# EasyEDA Pro project LUME_PEN_EasyEDA_Project_V1.2_2026-06-28.epro, schematic Charger_SCH
Board Name: 02_Charger; Create Date: 2026-05-08; Page Name: P1; Project Name: LUME; Schematic Name: Charger_SCH; Update Date: 2026-06-19; Company: EasyEDA.com; Page Size: A4; Version: V1.0
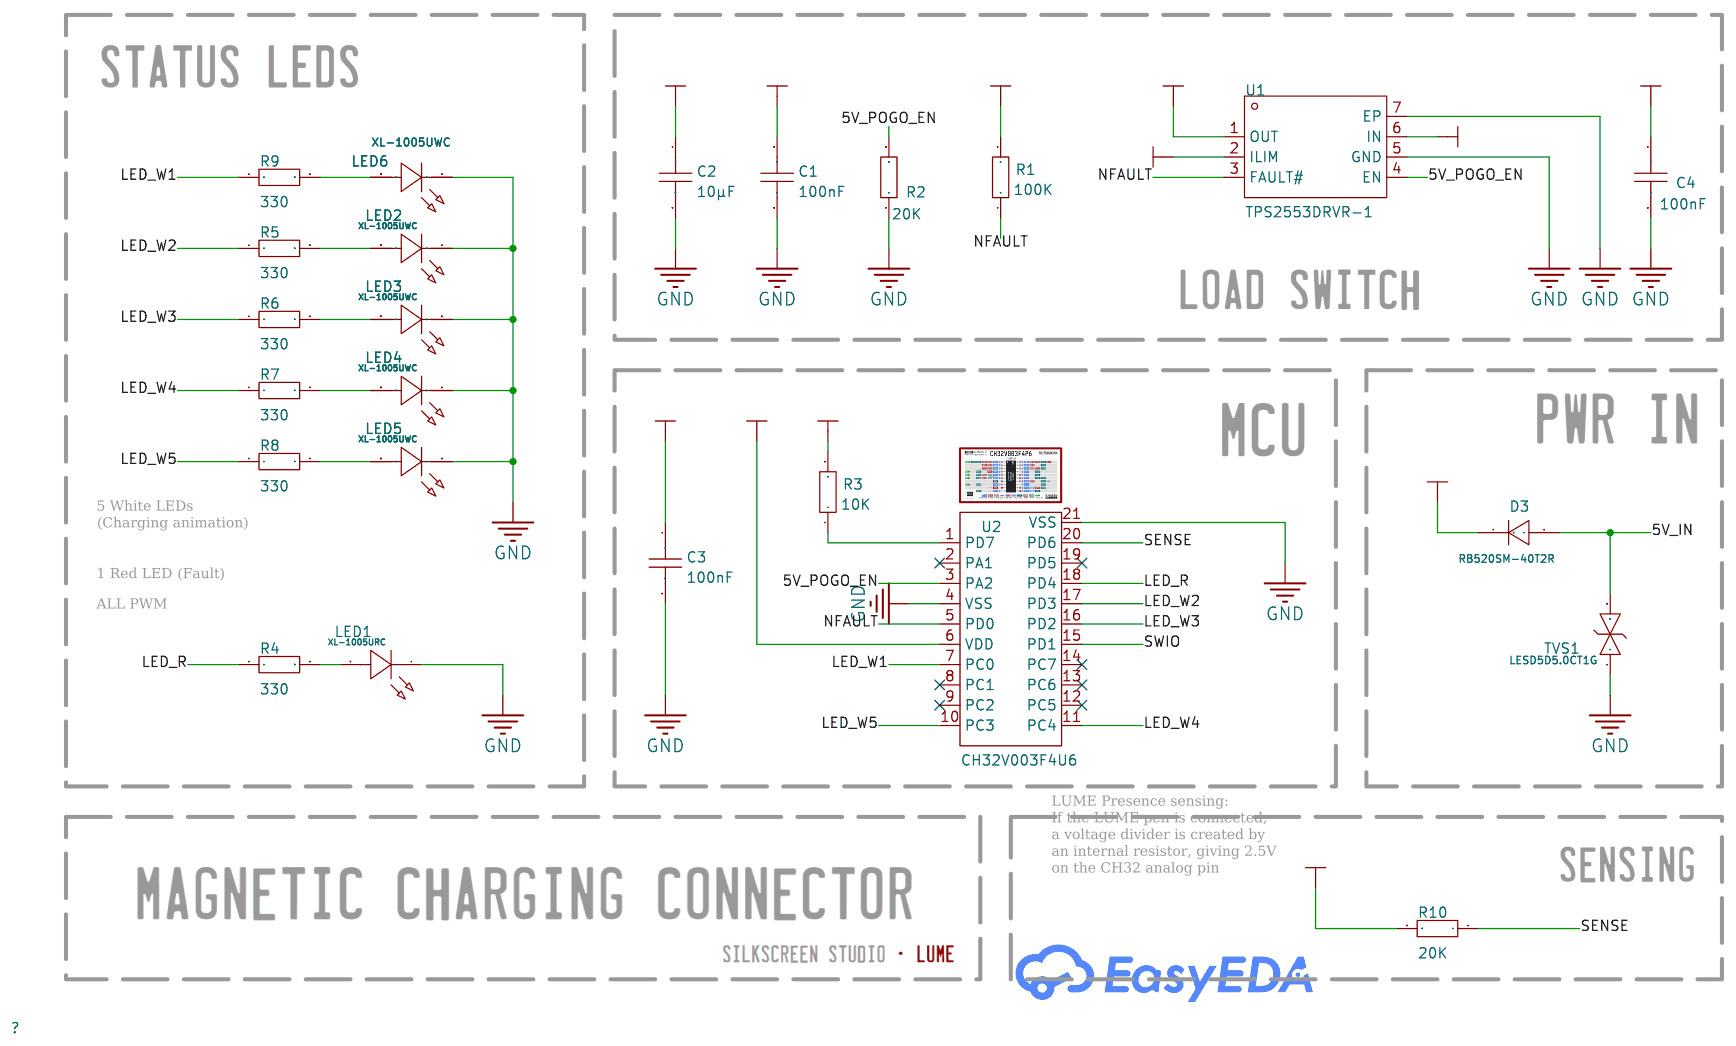
[diagram p1: schematic sheet]

## Parts
C1  100nF  [C0402]
C2  10µF  [C0402]
C3  100nF  [C0402]
C4  100nF  [C0402]
D3  RB520SM-40T2R  [SOD-523F_L1.7-W0.9-LS1.7-RD]
LED1  XL-1005URC  [LED0402-RD_YELLOW]
LED2  XL-1005UWC  [LED0402-RD_YELLOW]
LED3  XL-1005UWC  [LED0402-RD_YELLOW]
LED4  XL-1005UWC  [LED0402-RD_YELLOW]
LED5  XL-1005UWC  [LED0402-RD_YELLOW]
LED6  XL-1005UWC  [LED0402-RD_YELLOW]
R1  100K  [R0402]
R2  20K  [R0402]
R3  10K  [R0402]
R4  330  [R0402]
R5  330  [R0402]
R6  330  [R0402]
R7  330  [R0402]
R8  330  [R0402]
R9  330  [R0402]
R10  20K  [R0402]
TVS1  LESD5D5.0CT1G  [SOD-523_L1.2-W0.8-LS1.6-BI]
U1  TPS2553DRVR-1  [WSON-6_L2.0-W2.0-P0.65-BL-EP]
U2  CH32V003F4U6  [QFN-20_L3.0-W3.0-P0.40-TL-EP1.7]

## Library data of the parts
C1-C4 = CAP_0402: Supplier Part: C1525; Supplier Footprint: 0402
D3 = RB520SM-40T2R: Voltage - Forward(Vf@If):550mV@100mA Voltage - DC Reverse(Vr):40V Current - Rectified:200mA Reverse Leakage Current (Ir):10uA@40V Non-Repetitive Peak Forward Surge Current:1A; LCSC Part Name: 电压:40V 电流:200mA; Supplier Part: C253514; Manufacturer: ROHM(罗姆); Supplier Footprint: SOD-523; JLCPCB Part Class: Extended Part; Datasheet: https://item.szlcsc.com/datasheet/RB520SM-40T2R/248204.html; Supplier: LCSC; Voltage - Forward(Vf@If): 550mV@100mA; Voltage - DC Reverse(Vr): 40V; Current - Rectified: 200mA; Reverse Leakage Current (Ir): 10uA@40V; Non-Repetitive Peak Forward Surge Current: 1A
LED1-LED6 = XL-1005UWC_C20613596: Lamp Holder Type:- Illumination Color:White Voltage - Forward(Vf):2.8V Voltage - Forward(Vf):2.8V Power(Watts):75mW Forward Current:5mA Wavelength - Dominant:- Wavelength - Dominant:- Peak Wavelength:- Diode Configuration:Discrete Diode Lens Color:Yellow; LCSC Part Name: 0402冷白光贴片式发光二极管; Supplier Part: C20613596; Manufacturer: XINGLIGHT(成兴光); Supplier Footprint: 0402; JLCPCB Part Class: Extended Part; Datasheet: https://item.szlcsc.com/datasheet/XL-1005UWC/21979587.html; Supplier: LCSC; Illumination Color: White; Voltage - Forward(Vf): 2.8V; Power(Watts): 75mW; Forward Current: 5mA; Diode Configuration: Discrete Diode; Lens Color: Yellow Lens; Color Temperature: 15000K; Luminous Intensity: 1cd; Viewing Angle: 120°; Mounting Style: Top-mount; Operating Temperature: -40℃~+85℃
R1-R10 = Res_0402: Supplier Footprint: 0402
TVS1 = LESD5D5.0CT1G_C7433850: Polarity:- Reverse Stand-Off Voltage (Vrwm):5V Clamping Voltage:15V Peak Pulse Current (Ipp):5A Peak Pulse Power Dissipation (Ppp):75W Voltage - Breakdown:9V Reverse Leakage Current (Ir):1uA Number of Channels:1.0 Operating Temperature:-40℃~+150℃ Operatin; Supplier Part: C7433850; Manufacturer: KUU; Supplier Footprint: SOD-523; JLCPCB Part Class: Extended Part; Datasheet: https://item.szlcsc.com/datasheet/LESD5D5.0CT1G/8442902.html; Supplier: LCSC; Reverse Stand-Off Voltage (Vrwm): 5V; Clamping Voltage: 15V; Peak Pulse Current (Ipp): 5A; Peak Pulse Power Dissipation (Ppp): 75W; Voltage - Breakdown: 9V; Reverse Leakage Current (Ir): 1uA; Number of Channels: 1.0; Operating Temperature: -40℃~+150℃; level of protection: IEC 61000-4-2；IEC 61000-4-4; Type: ESD; Junction Capacitance: 15pF
U1 = TPS2553DRVR-1: Type:Load Switch Number of Channels:1 Control Input Logic:Active High Maximum Continuous Current:1.5A Voltage - Supply:2.5V~6.5V Voltage - Supply:2.5V~6.5V RDS(on):115mΩ Operating Temperature	-:-40℃~+105℃ Operating Temperature	-:-40℃~+105℃ Features:Overte; LCSC Part Name: 精密可调、带电流限制的电源分配开关; Supplier Part: C411878; Manufacturer: TI(德州仪器); Supplier Footprint: WSON-6-EP(2x2); JLCPCB Part Class: Extended Part; Datasheet: https://www.ti.com/cn/lit/gpn/tps2553-1; Supplier: LCSC; Type: Load Switch; Number of Channels: 1; Control Input Logic: Active High; Maximum Continuous Current: 1.5A; Voltage - Supply: 2.5V~6.5V; RDS(on): 115mΩ; Operating Temperature	-: -40℃~+105℃; Features: Overtemperature protection (OTP)；Overcurrent Protection(OCP)
U2 = CH32V003F4U6: CPU Core:RISC-V CPU Maximum Speed:48MHz Program Storage Size:16KB Number of I/O:18 Applications:-; LCSC Part Name: QingKe V2微处理器; Supplier Part: C5299908; Manufacturer: WCH(南京沁恒); Supplier Footprint: QFN-20(3X3); JLCPCB Part Class: Extended Part; Datasheet: https://item.szlcsc.com/datasheet/CH32V003F4U6/6049934.html; Supplier: LCSC; CPU Core: RISC-V; CPU Maximum Speed: 48MHz; Program Storage Size: 16KB; Number of I/O: 18

## Nets
5V_IN: D3.2(A) TVS1.2
5V_POGO: U1.1(OUT)
5V_POGO_EN: R2.2 U1.4(EN) U2.3(PA2)
GND: C1.2 C2.2 C3.2 C4.2 LED1.1(K) LED2.1(K) LED3.1(K) LED4.1(K) LED5.1(K) LED6.1(K) R2.1 TVS1.1 U1.5(GND) U1.7(EP) U2.4(VSS) U2.21(VSS)
VBUS: C1.1 C2.1 C3.1 C4.1 D3.1(C) R1.2 R3.2 R10.2 U1.2(ILIM) U1.6(IN) U2.6(VDD)
LED_R: R4.1 U2.18(PD4)
LED_W1: R9.1 U2.7(PC0)
LED_W2: R5.1 U2.17(PD3)
LED_W3: R6.1 U2.16(PD2)
LED_W4: R7.1 U2.11(PC4)
LED_W5: R8.1 U2.10(PC3)
NFAULT: R1.1 U1.3(FAULT#) U2.5(PD0)
SENSE: R10.1 U2.20(PD6)
SWIO: U2.15(PD1)
$1N881: R3.1 U2.1(PD7)
$1N1138: LED6.2(A) R9.2
$1N1214: LED2.2(A) R5.2
$1N1287: LED3.2(A) R6.2
$1N1360: LED4.2(A) R7.2
$1N1433: LED5.2(A) R8.2
$1N1609: LED1.2(A) R4.2

Not connected (* = marked no-connect by the designer): U2 2(PA1)* 8(PC1)* 9(PC2)* 12(PC5)* 13(PC6)* 14(PC7)* 19(PD5)*

## Notes on the sheet
- 5 White LEDs
  (Charging animation)
- 1 Red LED (Fault)
- ALL PWM
- LUME Presence sensing:
  If the LUME pen is connected,
  a voltage divider is created by
  an internal resistor, giving 2.5V
  on the CH32 analog pin
